# Altium schematic sheet MYBOARD_02-Power Diagram.SchDoc
size C
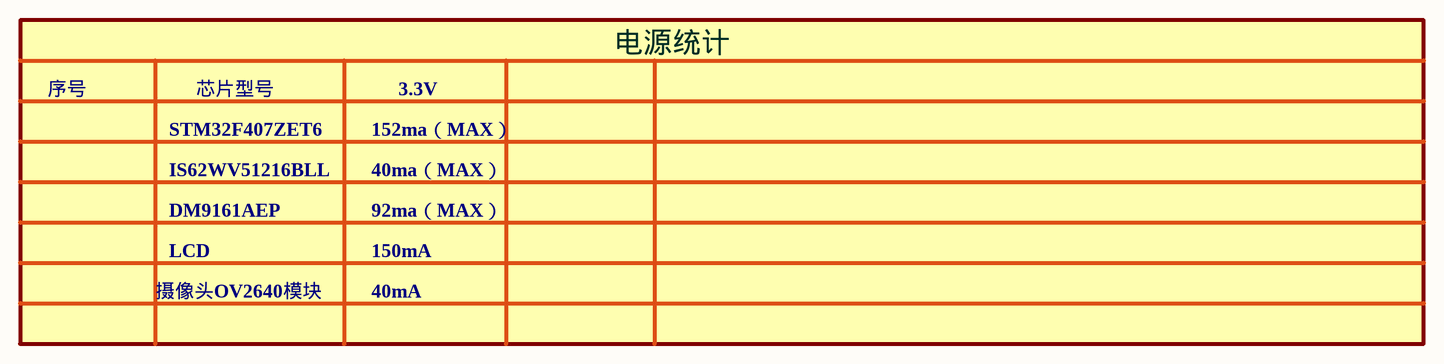
[diagram p0: MYBOARD_02-Power Diagram.SchDoc]

## Notes on the sheet
- 序号
- 芯片型号
- 3.3V
- 电源统计
- STM32F407ZET6
- 152ma（MAX）
- IS62WV51216BLL
- DM9161AEP
- 40ma（MAX）
- 92ma（MAX）
- 摄像头OV2640模块
- LCD
- 150mA
- 40mA